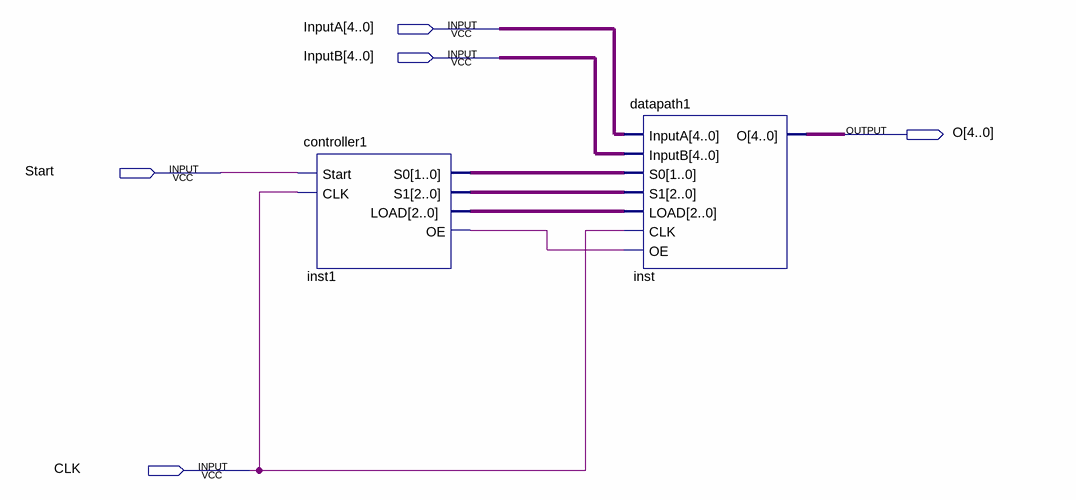
[diagram p0: schematic sheet]
// Quartus schematic RSCG.bdf as structural Verilog: 2 symbols, 5 pins
module RSCG (
  input  [4:0] InputA,
  input  [4:0] InputB,
  input  Start,
  input  CLK,
  output [4:0] O
);

  wire inst1_oe;
  wire [1:0] inst1_s0;
  wire [2:0] inst1_load, inst1_s1;

  controller1 inst1 (.Start(Start), .CLK(CLK), .S0(inst1_s0), .S1(inst1_s1), .LOAD(inst1_load), .OE(inst1_oe));
  datapath1 inst (
    .InputA(InputA), .InputB(InputB), .S0(inst1_s0), .S1(inst1_s1), .LOAD(inst1_load), .CLK(CLK),
    .OE(inst1_oe), .O(O));
endmodule
